# EAGLE design MainBoard (EAGLE 9.6.2)
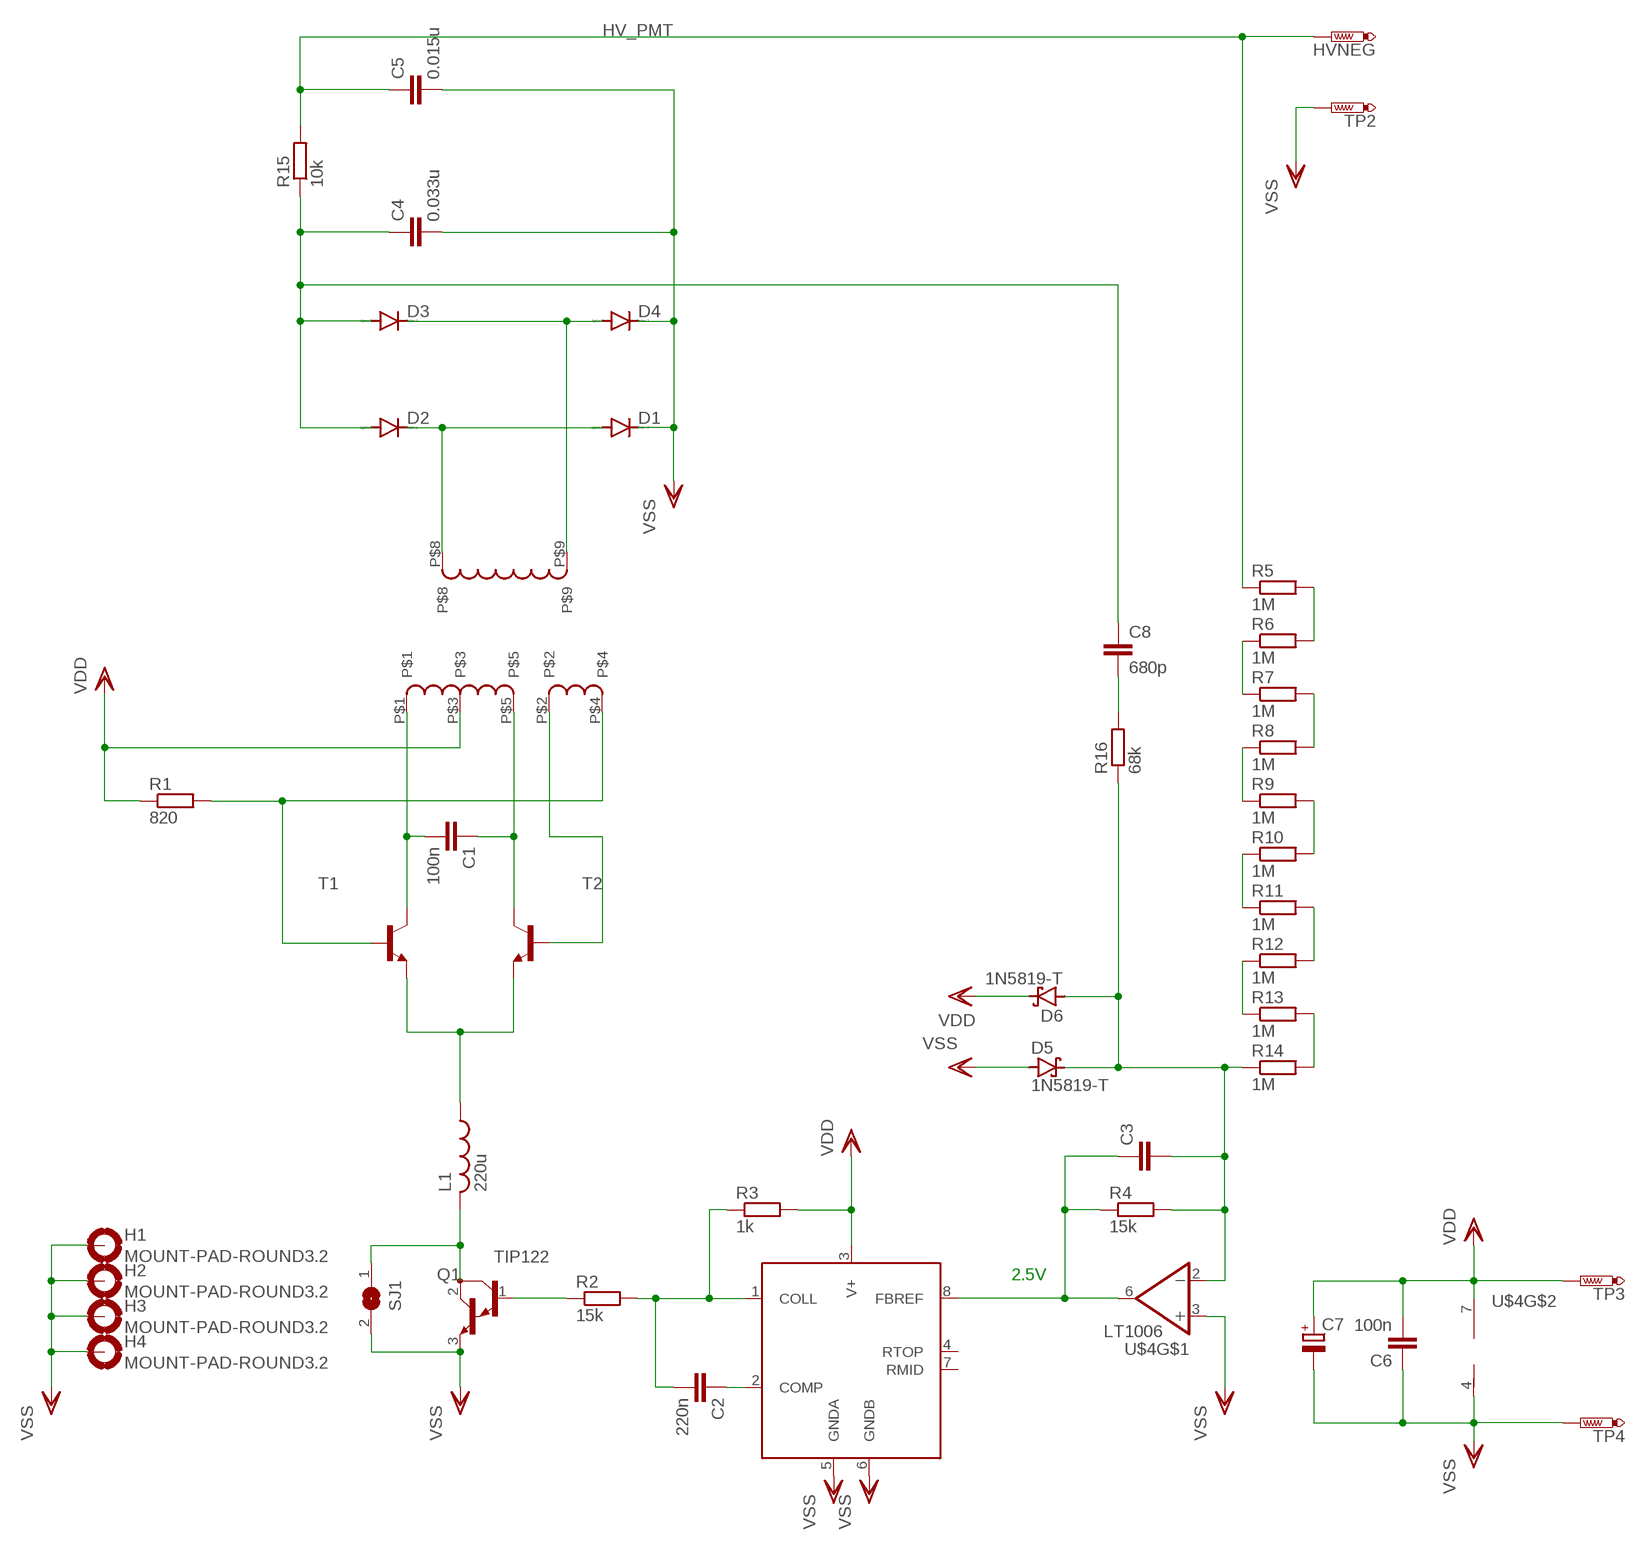
[diagram p0: schematic, sheet 1]

## Parts
C1  100n  C-EU075-032X103  [C075-032X103]
C2  220n  C-EU050-035X075  [C050-035X075]
C3  C-EU075-032X103  [C075-032X103]
C4  0.033u  C-EU225-087X268  [C225-087X268]
C5  0.015u  C-EU225-087X268  [C225-087X268]
C6  100n  C-EU075-032X103  [C075-032X103]
C7  CPOL-EUE2.5-7  [E2,5-7]
C8  680p  C-EU150-064X183  [C150-064X183]
D1  DIODE-DO41-10  [DO41-10]
D2  DIODE-DO41-10  [DO41-10]
D3  DIODE-DO41-10  [DO41-10]
D4  DIODE-DO41-10  [DO41-10]
D5  1N5819-T  [DO41-7.6]
D6  1N5819-T  [DO41-7.6]
H1  MOUNT-PAD-ROUND3.2  [3,2-PAD]
H2  MOUNT-PAD-ROUND3.2  [3,2-PAD]
H3  MOUNT-PAD-ROUND3.2  [3,2-PAD]
H4  MOUNT-PAD-ROUND3.2  [3,2-PAD]
HVNEG  PTR1PAD1-13Y  [P1-13Y]
L1  220u  L-US0207/15  [0207/15]
Q1  TIP122  [TO220]
R1  820  R-EU_0207/7  [0207/7]
R2  15k  R-EU_0207/7  [0207/7]
R3  1k  R-EU_0207/7  [0207/7]
R4  15k  R-EU_0207/7  [0207/7]
R5  1M  R-EU_0207/7  [0207/7]
R6  1M  R-EU_0207/7  [0207/7]
R7  1M  R-EU_0207/7  [0207/7]
R8  1M  R-EU_0207/7  [0207/7]
R9  1M  R-EU_0207/7  [0207/7]
R10  1M  R-EU_0207/7  [0207/7]
R11  1M  R-EU_0207/7  [0207/7]
R12  1M  R-EU_0207/7  [0207/7]
R13  1M  R-EU_0207/7  [0207/7]
R14  1M  R-EU_0207/7  [0207/7]
R15  10k  R-EU_0207/7  [0207/7]
R16  68k  R-EU_0207/7  [0207/7]
SJ1  SJ  [SJ]
T1  -NPN-TO92-EBC  [TO92-EBC]
T2  -NPN-TO92-EBC  [TO92-EBC]
TP2  PTR1PAD1-13Y  [P1-13Y]
TP3  PTR1PAD1-13Y  [P1-13Y]
TP4  PTR1PAD1-13Y  [P1-13Y]
U$1  FL2015  [FL2015-A]
U$3  LT1431  [SO08]
U$4  LT1006  [SO08]

## Nets
HV_PMT: C5.1 HVNEG.TP R5.1 R15.2
N$1: L1.1 T1.E T2.E
N$2: C1.2 T1.C U$1.P$1
N$3: C1.1 T2.C U$1.P$5
N$4: T2.B U$1.P$2
N$5: R1.2 T1.B U$1.P$4
N$6: L1.2 Q1.2(C) SJ1.1
N$7: D3.C D4.A U$1.P$9
N$8: D1.A D2.C U$1.P$8
N$9: Q1.1(B) R2.1
N$10: C2.2 R2.2 R3.1 U$3.1(COLL)
N$11: C3.2 D5.C D6.A R4.2 R14.1 R16.1 U$4.2(-IN)
N$12: C2.1 U$3.2(COMP)
N$13: C3.1 R4.1 U$3.8(FBREF) U$4.6(OUT)
N$14: C4.1 C8.1 D2.A D3.A R15.1
N$15: R5.2 R6.2
N$16: R6.1 R7.1
N$17: R7.2 R8.2
N$18: R8.1 R9.1
N$19: R9.2 R10.2
N$20: R10.1 R11.1
N$21: R11.2 R12.2
N$22: R12.1 R13.1
N$23: R13.2 R14.2
N$24: C8.2 R16.2
VDD: C6.2 C7.+ D6.C R1.1 R3.2 TP3.TP U$1.P$3 U$3.3(V+) U$4.7(V+)
VSS: C4.2 C5.2 C6.1 C7.- D1.C D4.C D5.A H1.B3,2(MOUNT) H2.B3,2(MOUNT) H3.B3,2(MOUNT) H4.B3,2(MOUNT) Q1.3(E) SJ1.2 TP2.TP TP4.TP U$3.5(GNDA) U$3.6(GNDB) U$4.3(+IN) U$4.4(V-)
Unconnected: U$3.4(RTOP) U$3.7(RMID)

## Notes on the sheet
- 2.5V

## Library data of the parts
C1-C6 C8 = rcl:C-EU: CAPACITOR, European symbol; SPICEPREFIX: C
C7 = rcl:CPOL-EU: POLARIZED CAPACITOR, European symbol; SPICEPREFIX: C
D1-D4 = diode:DIODE-: DIODE
D5 D6 = diode:1N581*: 1.0A SCHOTTKY BARRIER RECTIFIER Source: http://www.diodes.com/datasheets/ds23001.pdf
H1-H4 = holes:MOUNT-PAD-ROUND: MOUNTING PAD, round
HVNEG TP2-TP4 = testpad:PTR1: TEST PIN
L1 = rcl:L-US: INDUCTOR, American symbol; SPICEPREFIX: L
Q1 = transistor-npn:TIP122*: NPN Darlington Transistor
R1-R16 = rcl:R-EU_: RESISTOR, European symbol; SPICEPREFIX: R
SJ1 = jumper:SJ: SMD solder JUMPER
T1 T2 = transistor-neu-to92:*-NPN-: NPN Transistror
U$1 = FL2015:FL2015
U$3 = PMT_Supply_LBR:LT1431
U$4 = PMT_Supply_LBR:LT1006

## Board
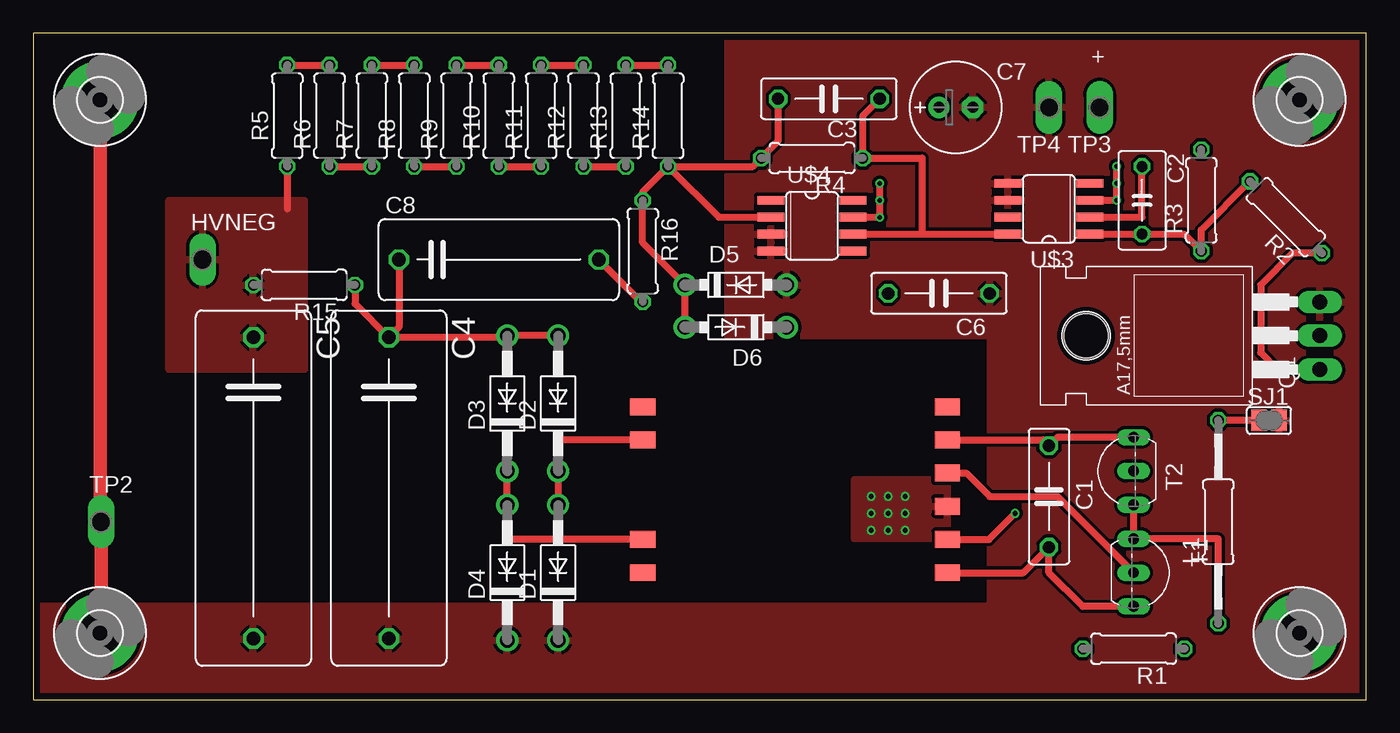
[diagram p1: board, top side]
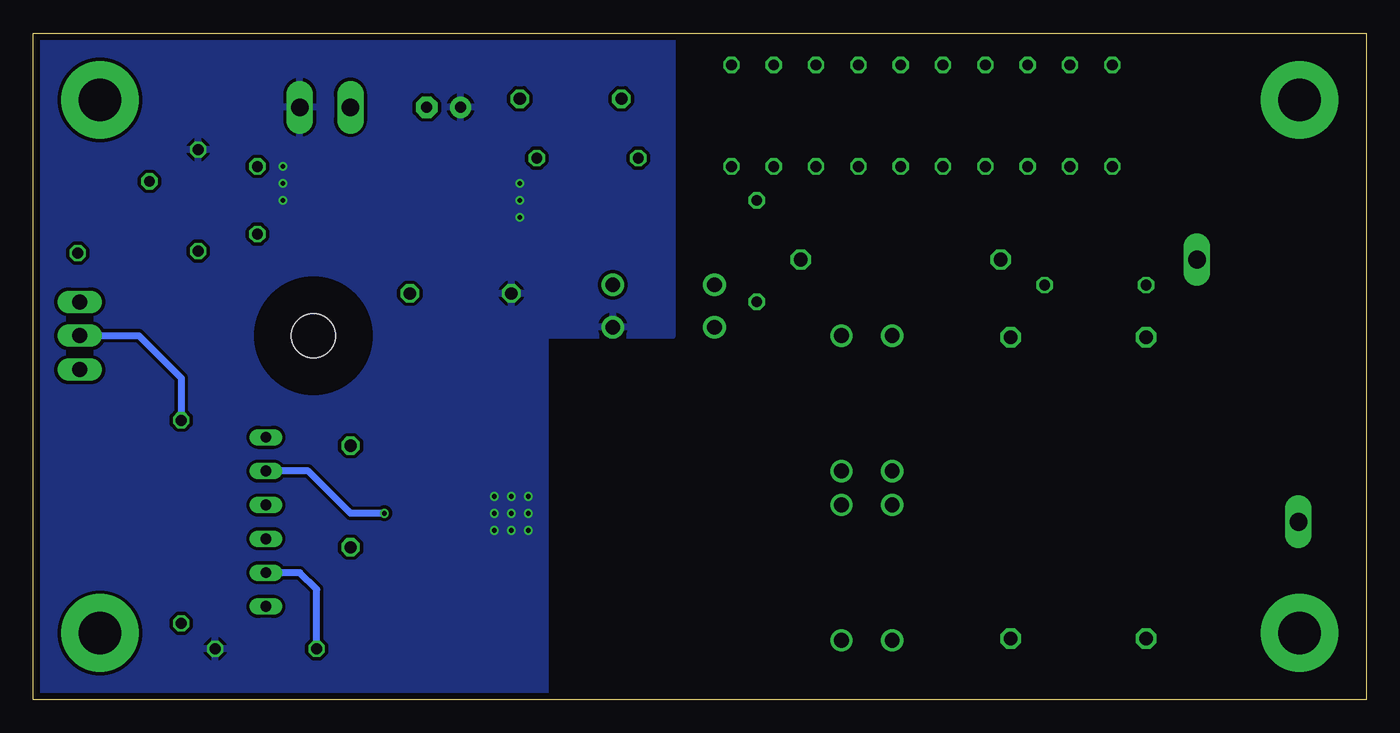
[diagram p2: board, bottom side, seen from below]

Size 100 x 50 mm. Coordinates in mm from the lower left corner, seen from the top.
Outline: 0,0 100,0 100,50 0,50 0,0
Copper layers (1*16): Top 0.035mm / dielectric 1.6mm / Bottom 0.035mm
Design rules "Elecrow_2-layer_PCB_eagle_rule": minimum track width 6mil, minimum drill 12mil, track to track 6mil, track to pad 6mil, pad to pad 6mil, via to via 8mil, smd to smd 0mil, copper to edge 20mil, drill to drill 10mil, minimum pad ring 6mil, minimum via ring 6mil, stop-mask expansion 0mil, vias tented up to drill 100mil, thermal gap 10mil

### Footprints (pad centres in the part's own frame; a part is rotated, then mirrored left to right if it is on the bottom)
C075-032X103 = drill 0.914 octagon: 1 -3.81,0; 2 3.81,0
C050-035X075 = drill 0.813 octagon: 1 -2.54,0; 2 2.54,0
C225-087X268 = drill 1.016 octagon: 1 -11.303,0; 2 11.303,0
E2,5-7 = drill 0.813 pad 1.6: + -1.27,0 | drill 0.813 pad 1.6 octagon: - 1.27,0
C150-064X183 = drill 1.016 octagon: 1 -7.493,0; 2 7.493,0
DO41-10 = drill 1.118: A 5.08,0; C -5.08,0
DO41-7.6 = drill 1.1 pad 1.7: A 3.81,0; C -3.81,0
3,2-PAD = drill 3.2 pad 5.842: B3,2 0,0
P1-13Y = drill 1.321 pad 1.905 long: TP 0,0
0207/15 = drill 0.813 octagon: 1 -7.62,0; 2 7.62,0
TO220 = drill 1.118 long: 1 -2.54,-6.35; 2 0,-6.35; 3 2.54,-6.35 | hole 3.302: 0,11.176
0207/7 = drill 0.813 octagon: 1 -3.81,0; 2 3.81,0
SJ = smd 1.168 x 1.6: 1 -0.762,0; 2 0.762,0
TO92-EBC = drill 0.813 long: B 0,-1.27; C 2.54,-1.27; E -2.54,-1.27
FL2015-A = smd 1.905 x 1.27: P$1 0,0; P$2 0,2.489; P$3 0,4.978; P$4 0,7.468; P$5 0,9.957; P$6 0,12.446; P$7 -22.86,12.446; P$8 -22.86,9.957; P$9 -22.86,2.489; P$10 -22.86,0
SO08 = smd 0.66 x 2.032: 1 -1.905,-3.073; 2 -0.635,-3.073; 3 0.635,-3.073; 4 1.905,-3.073; 5 1.905,3.073; 6 0.635,3.073; 7 -0.635,3.073; 8 -1.905,3.073

### Placement (x,y rotation side)
C1  76.2,15.24 270 top
C2  83.19,37.47 270 top
C3  59.69,45.09 180 top
C4  26.67,15.88 270 top
C5  16.51,15.88 270 top
C6  67.94,30.48 180 top
C7  69.22,44.45 0 top
C8  34.92,33.02 0 top
D1  39.37,9.53 90 top
D2  39.37,22.23 90 top
D3  35.56,22.23 90 top
D4  35.56,9.53 90 top
D5  52.7,31.11 0 top
D6  52.7,27.94 180 top
H1  5,5 0 top
H2  5,45 0 top
H3  95,5 0 top
H4  95,45 0 top
HVNEG  12.7,33.02 0 top
L1  88.9,13.34 90 top
Q1  90.17,27.3 90 top
R1  82.55,3.81 180 top
R2  93.98,36.2 135 top
R3  87.63,37.47 90 top
R4  58.42,40.64 180 top
R5  19.05,43.81 90 top
R6  22.23,43.81 90 top
R7  25.4,43.81 90 top
R8  28.57,43.81 90 top
R9  31.75,43.81 90 top
R10  34.92,43.81 90 top
R11  38.1,43.81 90 top
R12  41.27,43.81 90 top
R13  44.45,43.81 90 top
R14  47.62,43.81 90 top
R15  20.32,31.11 180 top
R16  45.72,33.66 270 top
SJ1  92.71,20.95 0 top
T1  83.82,9.53 270 top
T2  81.28,17.14 90 top
TP2  5.08,13.34 0 top
TP3  80.01,44.45 180 top
TP4  76.2,44.45 180 top
U$1  68.58,9.53 0 top
U$3  76.2,36.83 90 top
U$4  58.42,35.56 270 top

### Tracks (layer width: path | path; a pad name or v marks a point on that pad's centre or on a via)
HV_PMT
  Top 0.508: R5.1 19.05,36.83
  pour Top: 10.16,37.47 20.32,37.47 20.32,24.77 10.16,24.77
N$1
  Top 0.508: T2.E T1.E 88.9,12.06 L1.1
N$2
  Top 0.508: T1.C 78.74,6.99 76.2,9.53 C1.2 74.3,9.53 U$1.P$1
N$3
  Top 0.508: T2.C 76.83,19.68 C1.1 75.77,19.48 U$1.P$5
N$4  (via drill 0.35)
  Top 0.508: U$1.P$2 71.7,12.01 v73.66,13.97
  Bottom 0.508: v73.66,13.97 76.2,13.97 79.38,17.14 T2.B
N$5
  Top 0.508: U$1.P$4 70,16.99 71.75,15.24 76.83,15.24 T1.B
  Bottom 0.508: R1.2 78.74,8.26 80.01,9.53 T1.B
N$6
  Top 0.508: SJ1.1 L1.2
  Bottom 0.508: Q1.2 92.08,27.3 88.9,24.13 L1.2
N$7
  Top 0.508: U$1.P$9 35.56,12.01 D4.A D3.C
N$8
  Top 0.508: U$1.P$8 39.37,19.48 D2.C D1.A
N$9
  Top 0.508: R2.1 94.46,33.5 92.08,31.11 92.08,26.04 93.34,24.77 Q1.1
N$10
  Top 0.508: U$3.1 C2.2 86.36,34.92 R3.1 87.63,35.23 R2.2
N$11
  Top 0.508: R14.1 53.98,40.01 R4.2 55.88,41.91 C3.2 | R14.1 51.44,36.2 U$4.2 | D6.A D5.C 45.72,34.29 R16.1 45.72,38.1 R14.1
N$12
  Top 0.508: U$3.2 83.19,36.2 C2.1
N$13
  Top 0.508: 66.67,34.92 66.67,40.64 R4.1 62.23,43.81 C3.1 | U$4.6 66.67,34.92 | 66.67,34.92 U$3.8
N$14
  Top 0.508: D2.A D3.A 35.56,27.18 C4.1 | R15.1 24.13,29.72 C4.1 | C8.1 27.43,27.94 C4.1
N$15
  Top 0.508: R5.2 R6.2
N$16
  Top 0.508: R6.1 R7.1
N$17
  Top 0.508: R7.2 R8.2
N$18
  Top 0.508: R8.1 R9.1
N$19
  Top 0.508: R9.2 R10.2
N$20
  Top 0.508: R10.1 R11.1
N$21
  Top 0.508: R11.2 R12.2
N$22
  Top 0.508: R12.1 R13.1
N$23
  Top 0.508: R13.2 R14.2
N$24
  Top 0.508: C8.2 45.59,29.84 R16.2
VDD  (via drill 0.35)
  Top 0.508: U$4.7 v63.5,36.2 v63.5,38.73 | U$3.3 v81.28,37.47 v81.28,40.01
  other vias: 63.5,37.47 81.28,38.73 65.41,15.24 65.41,13.97 65.41,12.7 64.14,12.7 64.14,13.97 64.14,15.24 62.87,15.24 62.87,13.97 62.87,12.7
  pour Bottom (isolate 0.254): 52.07,50.16 52.07,27.3 61.59,27.3 61.59,0 99.69,0 99.69,50.16
  pour Top (isolate 0.254): 61.59,16.51 68.58,16.51 68.58,12.06 61.59,12.06
VSS
  Top 0.508: 5.08,5.08 H1.B3,2 | 5,13.41 TP2.TP
  Top 1.016: TP2.TP 5.08,5.08 | H2.B3,2 5,13.41
  pour Top (isolate 0.254): 99.69,50.16 52.07,50.16 52.07,27.3 71.75,27.3 71.75,6.99 0,6.99 0,0 99.69,0

### Text on the board
tNames: +